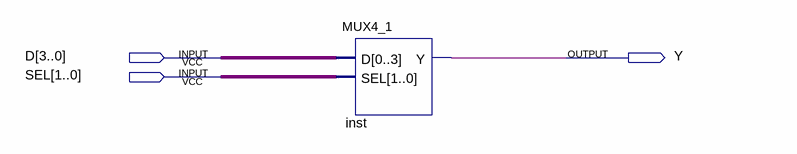
[diagram p0: schematic sheet]
// Quartus schematic MUX_4_1.bdf as structural Verilog: 1 symbols, 3 pins
module MUX_4_1 (
  input  [3:0] D,
  input  [1:0] SEL,
  output Y
);

  MUX4_1 inst (.D(D), .SEL(SEL), .Y(Y));
endmodule
